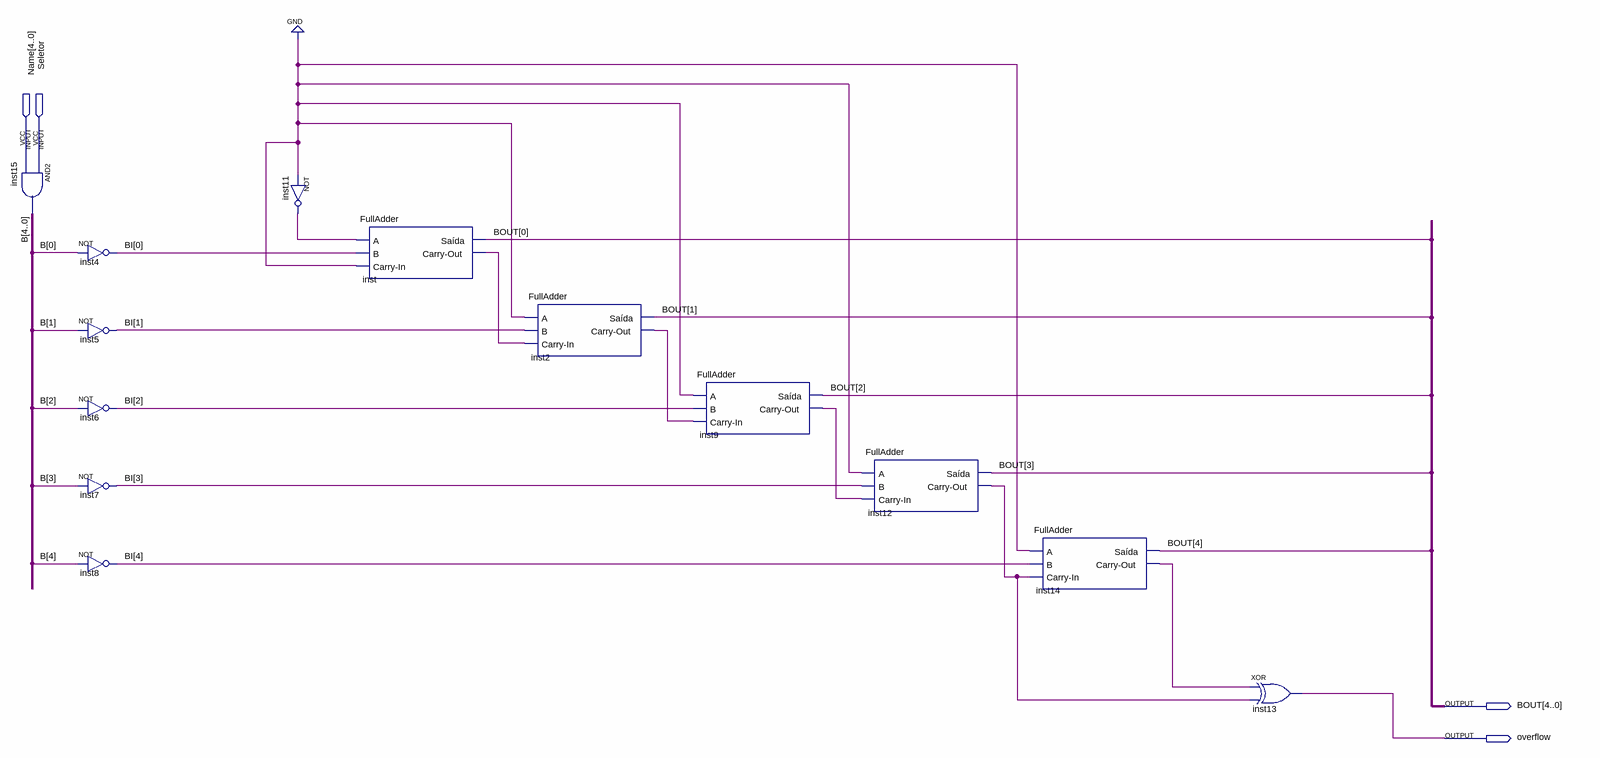
[diagram p0: schematic sheet]
// Quartus schematic Complemento2B.bdf as structural Verilog: 13 symbols, 4 pins
module Complemento2B (
  input  [4:0] Name,
  input  Seletor,
  output [4:0] BOUT,
  output overflow
);

  wire inst2_carry_out, inst9_carry_out, inst11_out, inst12_carry_out, inst14_carry_out, inst_carry_out;
  wire [4:0] B, BI;

  assign B = {5{Seletor}} & Name;  // AND2 inst15, 5 bits wide
  not inst4 (BI[0], B[0]);
  not inst5 (BI[1], B[1]);
  not inst6 (BI[2], B[2]);
  not inst7 (BI[3], B[3]);
  not inst8 (BI[4], B[4]);
  not inst11 (inst11_out, 1'b0);
  FullAdder inst (.A(inst11_out), .B(BI[0]), .\Carry-In (1'b0), .\Saída (BOUT[0]), .\Carry-Out (inst_carry_out));
  FullAdder inst2 (.A(1'b0), .B(BI[1]), .\Carry-In (inst_carry_out), .\Saída (BOUT[1]), .\Carry-Out (inst2_carry_out));
  FullAdder inst9 (.A(1'b0), .B(BI[2]), .\Carry-In (inst2_carry_out), .\Saída (BOUT[2]), .\Carry-Out (inst9_carry_out));
  FullAdder inst12 (
    .A(1'b0), .B(BI[3]), .\Carry-In (inst9_carry_out), .\Saída (BOUT[3]), .\Carry-Out (inst12_carry_out));
  FullAdder inst14 (
    .A(1'b0), .B(BI[4]), .\Carry-In (inst12_carry_out), .\Saída (BOUT[4]), .\Carry-Out (inst14_carry_out));
  xor inst13 (overflow, inst14_carry_out, inst12_carry_out);
endmodule
